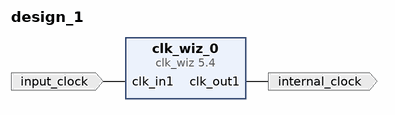
[diagram p0: block diagram of the top level]
# Vivado block design design_1, xc7a35tcpg236-1, Vivado 2017.4
create_bd_design design_1

create_bd_port -dir O -type clk internal_clock
create_bd_port -dir I -type clk input_clock
set_property -dict {CONFIG.FREQ_HZ 100000000} [get_bd_ports input_clock]

create_bd_cell -type ip -vlnv xilinx.com:ip:clk_wiz:5.4 clk_wiz_0
set_property -dict [list \
  CONFIG.CLKOUT1_REQUESTED_OUT_FREQ 210.000 \
  CONFIG.MMCM_DIVCLK_DIVIDE 5 \
  CONFIG.MMCM_CLKFBOUT_MULT_F 49.875 \
  CONFIG.MMCM_CLKOUT0_DIVIDE_F 4.750 \
  CONFIG.CLKOUT1_JITTER 216.918 \
  CONFIG.CLKOUT1_PHASE_ERROR 293.793 \
] [get_bd_cells clk_wiz_0]

# ---- connections ----

connect_bd_net [get_bd_pins clk_wiz_0/clk_out1] [get_bd_ports internal_clock]
connect_bd_net [get_bd_ports input_clock] [get_bd_pins clk_wiz_0/clk_in1]

validate_bd_design
save_bd_design
